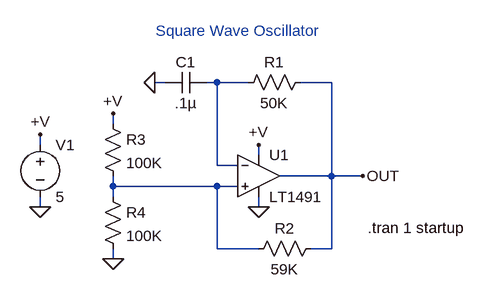
[diagram p0: schematic 1491.asc]
1491.asc, the LTspice schematic file:
Version 4
SHEET 1 896 680
WIRE 48 96 32 96
WIRE 128 96 112 96
WIRE 176 96 128 96
WIRE 304 96 256 96
WIRE -32 160 -32 144
WIRE -144 192 -144 176
WIRE 192 208 192 192
WIRE 128 224 128 96
WIRE 160 224 128 224
WIRE 304 240 304 96
WIRE 304 240 224 240
WIRE 352 240 304 240
WIRE -32 256 -32 240
WIRE 128 256 -32 256
WIRE 160 256 128 256
WIRE -32 272 -32 256
WIRE -144 288 -144 272
WIRE 192 288 192 272
WIRE 128 352 128 256
WIRE 192 352 128 352
WIRE 304 352 304 240
WIRE 304 352 272 352
WIRE -32 368 -32 352
FLAG -144 288 0
FLAG 192 192 +V
FLAG -144 176 +V
FLAG 32 96 0
FLAG 192 288 0
FLAG -32 368 0
FLAG 352 240 OUT
FLAG -32 144 +V
SYMBOL voltage -144 176 R0
SYMATTR InstName V1
SYMATTR Value 5
SYMBOL res 272 80 R90
WINDOW 0 0 56 VBottom 2
WINDOW 3 32 56 VTop 2
SYMATTR InstName R1
SYMATTR Value 50K
SYMBOL cap 112 80 R90
WINDOW 0 0 32 VBottom 2
WINDOW 3 32 32 VTop 2
SYMATTR InstName C1
SYMATTR Value .1µ
SYMBOL res 288 336 R90
WINDOW 0 0 56 VBottom 2
WINDOW 3 32 56 VTop 2
SYMATTR InstName R2
SYMATTR Value 59K
SYMBOL res -48 144 R0
SYMATTR InstName R3
SYMATTR Value 100K
SYMBOL res -48 256 R0
SYMATTR InstName R4
SYMATTR Value 100K
SYMBOL opamps\\LT1491 192 176 R0
SYMATTR InstName U1
TEXT 360 320 Left 2 !.tran 1 startup
TEXT 160 32 Bottom 2 ;Square Wave Oscillator

The netlist it stands for:
* 1491.asc
V1 +V 0 5
R1 OUT N001 50K
C1 N001 0 .1µ
R2 OUT N002 59K
R3 +V N002 100K
R4 N002 0 100K
XU1 N002 N001 +V 0 OUT LT1491  ; pins In+ In- V+ V- OUT
.tran 1 startup
* Square Wave Oscillator
.backanno
.end